# EAGLE design nodeBoard (EAGLE 8.6.0)
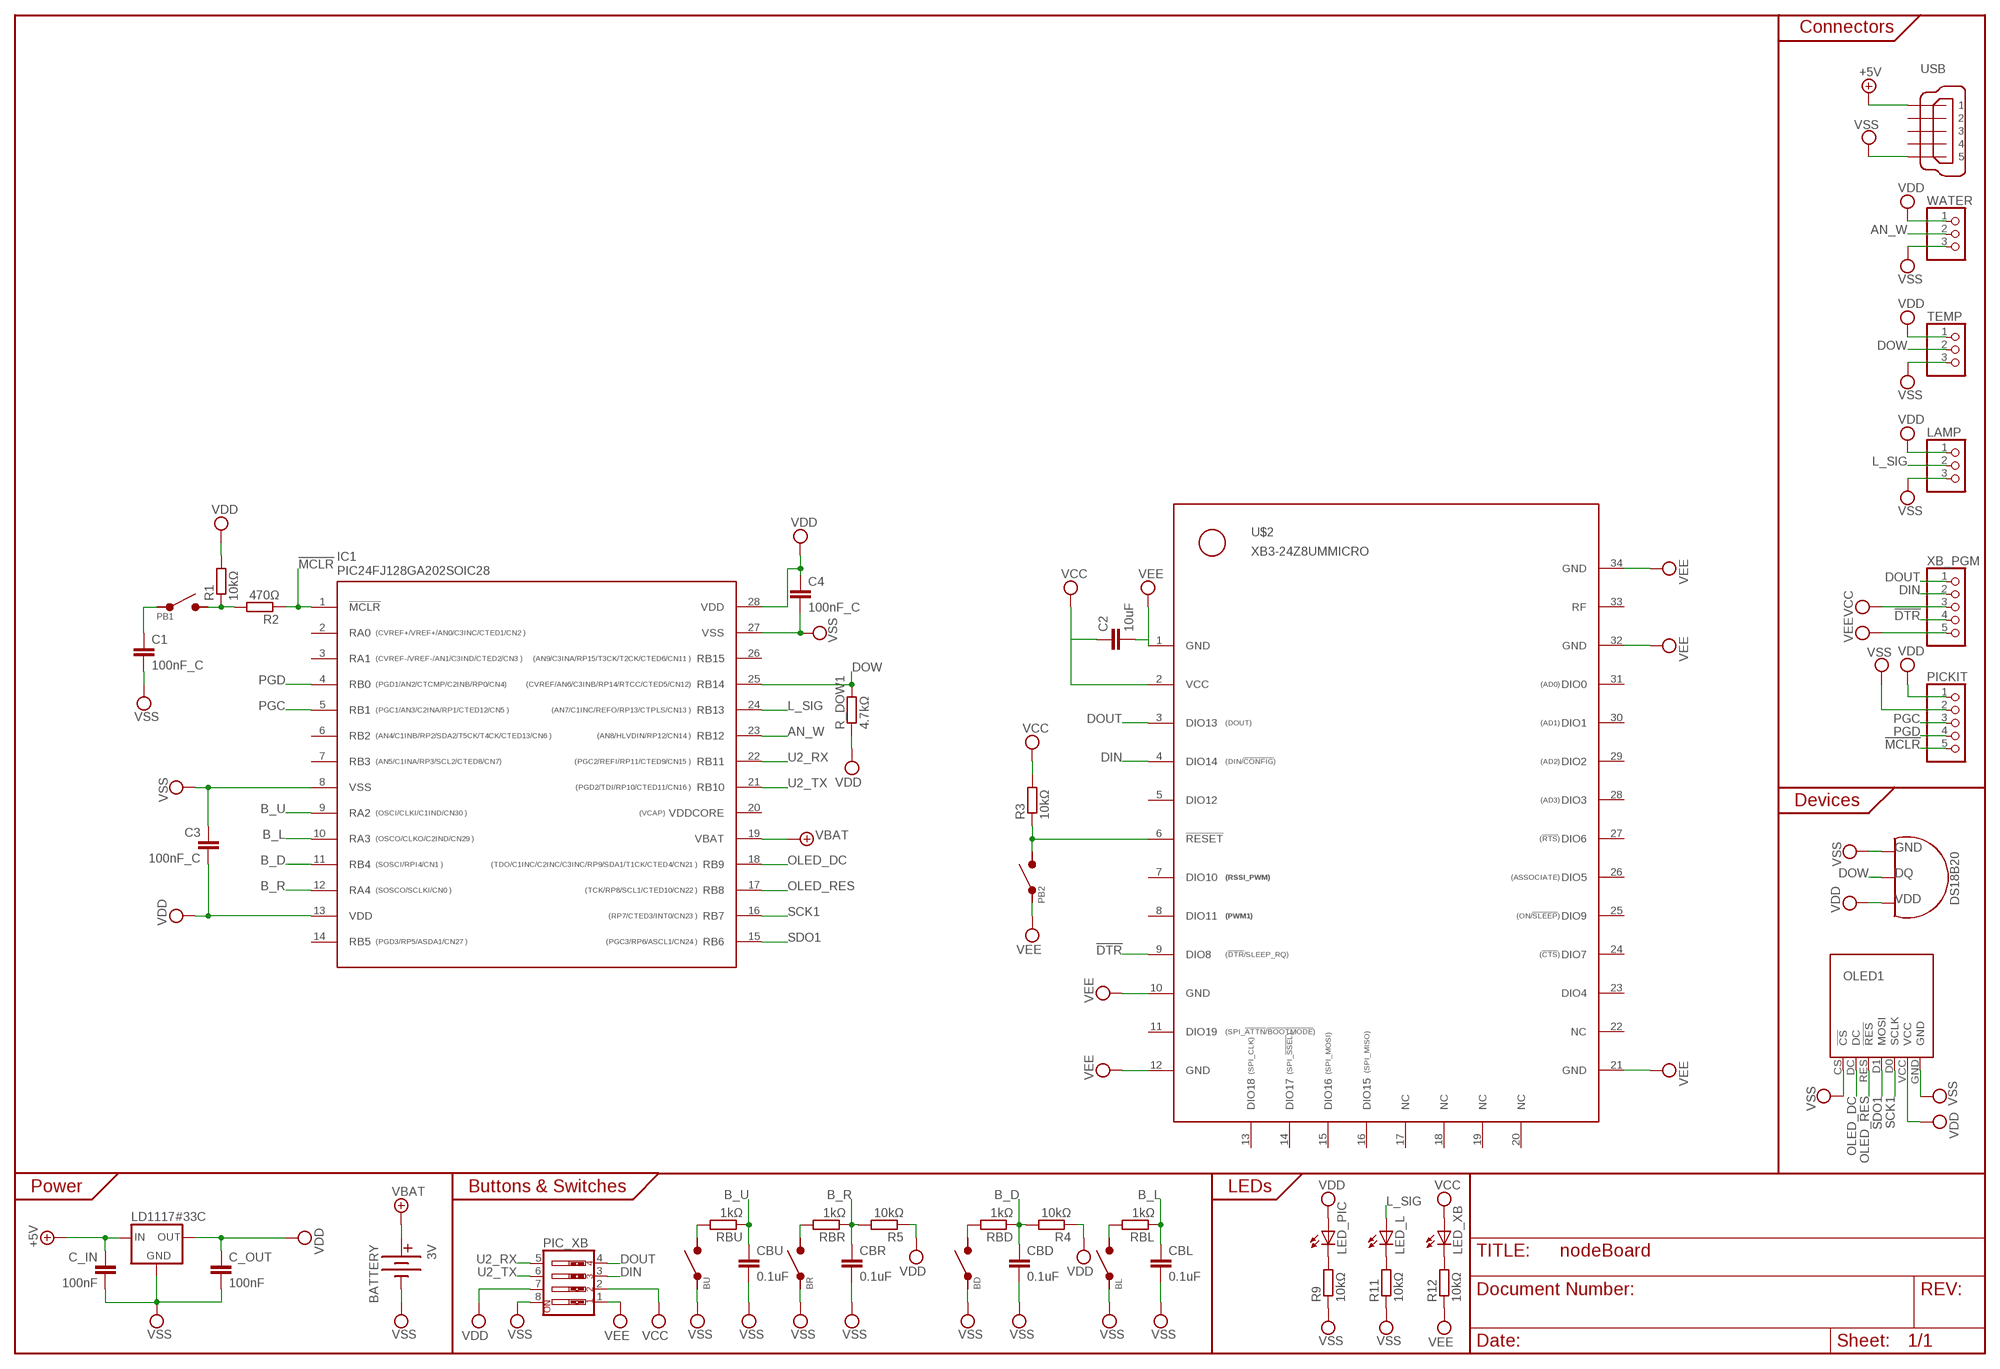
[diagram p0: schematic, sheet 1]

## Parts
3V  BATTERY  [20MM_CELLHOLDER]
BD  PUSHBUTTON_4LEG_SMD  [TACTILE_SWITCH_SMD_6.2MM_BROWN]
BL  PUSHBUTTON_4LEG_SMD  [TACTILE_SWITCH_SMD_6.2MM_BROWN]
BR  PUSHBUTTON_4LEG_SMD  [TACTILE_SWITCH_SMD_6.2MM_BROWN]
BU  PUSHBUTTON_4LEG_SMD  [TACTILE_SWITCH_SMD_6.2MM_BROWN]
C1  100nF_C  C-EUC0805  [C0805]
C2  10uF  C-EUC0805  [C0805]
C3  100nF_C  C-EUC0805  [C0805]
C4  100nF_C  C-EUC0805  [C0805]
C_IN  100nF  C-EUC0805  [C0805]
C_OUT  100nF  C-EUC0805  [C0805]
CBD  0.1uF  C-EUC0805  [C0805]
CBL  0.1uF  C-EUC0805  [C0805]
CBR  0.1uF  C-EUC0805  [C0805]
CBU  0.1uF  C-EUC0805  [C0805]
IC1  PIC24FJ128GA202SOIC28  [SOIC28L]
LAMP  PINHD-1X3  [1X03]
LED_L  LEDCHIPLED_0805  [CHIPLED_0805]
LED_PIC  LEDCHIPLED_0805  [CHIPLED_0805]
LED_XB  LEDCHIPLED_0805  [CHIPLED_0805]
OLED1  OLED_7PIN_SPI  [OLED_7PIN]
PB1  PUSHBUTTON_2LEG  [PUSHBUTTON_6X3.5MM]
PB2  PUSHBUTTON_2LEG  [PUSHBUTTON_6X3.5MM]
PIC_XB  SW_DIP-4  [EDG-04]
PICKIT  PINHD-1X5  [1X05]
R1  10kΩ  R-EU_R0805  [R0805]
R2  470Ω  R-EU_R0805  [R0805]
R3  10kΩ  R-EU_R0805  [R0805]
R4  10kΩ  R-EU_R0805  [R0805]
R5  10kΩ  R-EU_R0805  [R0805]
R9  10kΩ  R-EU_R0805  [R0805]
R11  10kΩ  R-EU_R0805  [R0805]
R12  10kΩ  R-EU_R0805  [R0805]
R_DOW1  4.7kΩ  R-EU_R0805  [R0805]
RBD  1kΩ  R-EU_R0805  [R0805]
RBL  1kΩ  R-EU_R0805  [R0805]
RBR  1kΩ  R-EU_R0805  [R0805]
RBU  1kΩ  R-EU_R0805  [R0805]
TEMP  PINHD-1X3  [1X03]
U$1  LD1117#33C  [DPACK]
U$2  XB3-24Z8UMMICRO  [XBEE3_MICRO]
U$7  DS18B20  [TO92]
USB  MINI-USB-32005-201  [32005-201]
WATER  PINHD-1X3  [1X03]
XB_PGM  PINHD-1X5  [1X05]

## Nets
!DTR: U$2.9(DIO8) XB_PGM.4
!MCLR: IC1.1(!MCLR) PICKIT.5 R2.1
+5V: C_IN.1 U$1.3(IN) USB.1
AN_W: IC1.23(RB12) WATER.2
B_D: CBD.1 IC1.11(RB4) R4.2 RBD.1
B_L: CBL.1 IC1.10(RA3) RBL.1
B_R: CBR.1 IC1.12(RA4) R5.2 RBR.1
B_U: CBU.1 IC1.9(RA2) RBU.1
DIN: PIC_XB.3 U$2.4(DIO14) XB_PGM.2
DOUT: PIC_XB.4 U$2.3(DIO13) XB_PGM.1
DOW: IC1.25(RB14) R_DOW1.2 TEMP.2 U$7.2(DQ)
L_SIG: IC1.24(RB13) LAMP.2 LED_L.A
N$1: C1.1 PB1.P$1
N$2: PB2.P$2 R3.1 U$2.6(!RESET)
N$3: PB1.P$2 R1.1 R2.2
N$4: BU.B1 BU.B2 RBU.2
N$6: BL.B1 BL.B2 RBL.2
N$7: BR.B1 BR.B2 RBR.2
N$8: BD.B1 BD.B2 RBD.2
N$9: LED_L.C R11.2
N$10: LED_XB.C R12.2
N$11: LED_PIC.C R9.2
OLED_DC: IC1.18(RB9) OLED1.DC
OLED_RES: IC1.17(RB8) OLED1.RES(!RES)
PGC: IC1.5(RB1) PICKIT.3
PGD: IC1.4(RB0) PICKIT.4
SCK1: IC1.16(RB7) OLED1.D0(SCLK)
SDO1: IC1.15(RB6) OLED1.D1(MOSI)
U2_RX: IC1.22(RB11) PIC_XB.5
U2_TX: IC1.21(RB10) PIC_XB.6
VBAT: 3V.+@1(+) 3V.+@2(+) IC1.19(VBAT)
VCC: C2.1 LED_XB.A PIC_XB.2 R3.2 U$2.2(VCC) XB_PGM.3
VDD: C3.2 C4.1 C_OUT.1 IC1.13(VDD) IC1.28(VDD) LAMP.1 LED_PIC.A OLED1.VCC PIC_XB.7 PICKIT.1 R1.2 R4.1 R5.1 R_DOW1.1 TEMP.1 U$1.2(OUT) U$7.3(VDD) WATER.1
VEE: C2.2 PB2.P$1 PIC_XB.1 R12.1 U$2.1(GND) U$2.10(GND) U$2.12(GND) U$2.21(GND) U$2.32(GND) U$2.34(GND) XB_PGM.5
VSS: 3V.- BD.A1 BD.A2 BL.A1 BL.A2 BR.A1 BR.A2 BU.A1 BU.A2 C1.2 C3.1 C4.2 C_IN.2 C_OUT.2 CBD.2 CBL.2 CBR.2 CBU.2 IC1.8(VSS) IC1.27(VSS) LAMP.3 OLED1.CS(!CS) OLED1.GND PIC_XB.8 PICKIT.2 R9.1 R11.1 TEMP.3 U$1.1(GND) U$7.1(GND) USB.5 WATER.3
Unconnected: IC1.2(RA0) IC1.3(RA1) IC1.6(RB2) IC1.7(RB3) IC1.14(RB5) IC1.26(RB15) U$2.5(DIO12) U$2.7(DIO10) U$2.8(DIO11) U$2.11(DIO19) U$2.13(DIO18) U$2.14(DIO17) U$2.15(DIO16) U$2.16(DIO15) U$2.17(NC) U$2.18(NC) U$2.19(NC) U$2.20(NC) U$2.22(NC) U$2.23(DIO4) U$2.24(DIO7) U$2.25(DIO9) U$2.26(DIO5) U$2.27(DIO6) U$2.28(DIO3) U$2.29(DIO2) U$2.30(DIO1) U$2.31(DIO0) U$2.33(RF) USB.2 USB.3 USB.4

## Notes on the sheet
- Connectors
- Devices
- Power | Buttons & Switches | LEDs

## Power pins joined to a net without a drawn wire
VDDCORE: IC1.20(VDDCORE)

## Library data of the parts
3V = CustomLib:BATTERY
BD BL BR BU = CustomLib:PUSHBUTTON_4LEG_SMD
C1-C4 C_IN C_OUT CBD CBL CBR CBU = rcl:C-EU: CAPACITOR, European symbol; SPICEPREFIX: C
IC1 = CustomLib:PIC24FJ128GA202
LAMP TEMP WATER = pinhead:PINHD-1X3: PIN HEADER
LED_L LED_PIC LED_XB = led:LED: LED OSRAM: - CHIPLED LG R971, LG N971, LY N971, LG Q971, LY Q971, LO R971, LY R971 LH N974, LH R974 LS Q976, LO Q976, LY Q976 LO Q996 - Hyper CHIPLED LW Q18S LB Q993, LB Q99A, LB R99A - SideLED LS A670, LO A670, LY A670, LG A670, LP A670 LB A673, LV A673, LT A673, LW A673 LH A674 LY A675 LS A676, LA A676, LO A676, LY A676, LW A676 LS A679, LY A679, LG A679 - Hyper Micro SIDELED® LS Y876, LA Y876, LO Y876, LY Y876 LT Y87S - SmartLED LW L88C, LW L88S LB L89C, LB L89S, LG L890 LS L89K, LO L89K, LY L89K LS L896, LA L896, LO L896, LY L896 - TOPLED LS T670, LO T670, LY T670, LG T670, LP T670 LSG T670, LSP T670, LSY T670, LOP T670, LYG T670 LG T671, LOG T671, LSG T671 LB T673, LV T673, LT T673, LW T673 LH T674 LS T676, LA T676, LO T676, LY T676, LB T676, LH T676, LSB T676, LW T676 LB T67C, LV T67C, LT T67C, LS T67K, LO T67K, LY T67K, LW E67C LS E67B, LA E67B, LO E67B, LY E67B, LB E67C, LV E67C, LT E67C LW T67C LS T679, LY T679, LG T679 LS T770, LO T770, LY T770, LG T770, LP T770 LB T773, LV T773, LT T773, LW T773 LH T774 LS E675, LA E675, LY E675, LS T675 LS T776, LA T776, LO T776, LY T776, LB T776 LHGB T686 LT T68C, LB T68C - Hyper Mini TOPLED® LB M676 - Mini TOPLED Santana® LG M470 LS M47K, LO M47K, LY M47K Source: http://www.osram.convergy.de LUXEON: - LUMILED® LXK2-PW12-R00, LXK2-PW12-S00, LXK2-PW14-U00, LXK2-PW14-V00 LXK2-PM12-R00, LXK2-PM12-S00, LXK2-PM14-U00 LXK2-PE12-Q00, LXK2-PE12-R00, LXK2-PE12-S00, LXK2-PE14-T00, LXK2-PE14-U00 LXK2-PB12-K00, LXK2-PB12-L00, LXK2-PB12-M00, LXK2-PB14-N00, LXK2-PB14-P00, LXK2-PB14-Q00 LXK2-PR12-L00, LXK2-PR12-M00, LXK2-PR14-Q00, LXK2-PR14-R00 LXK2-PD12-Q00, LXK2-PD12-R00, LXK2-PD12-S00 LXK2-PH12-R00, LXK2-PH12-S00 LXK2-PL12-P00, LXK2-PL12-Q00, LXK2-PL12-R00 Source: www.luxeon.com KINGBRIGHT: KA-3528ASYC Source: www.kingbright.com
OLED1 = CustomLib:OLED_7PIN_SPI
PB1 PB2 = CustomLib:PUSHBUTTON_2LEG
PIC_XB = special:SW_DIP-4: DIP SWITCH
PICKIT XB_PGM = pinhead:PINHD-1X5: PIN HEADER
R1-R5 R9 R11 R12 R_DOW1 RBD RBL RBR RBU = rcl:R-EU_: RESISTOR, European symbol; SPICEPREFIX: R
U$1 = CustomLib:LD1117#33C
U$2 = CustomLib:XB3-24Z8UM: XB3-24Z8UM Xbee 3 micro module by DIGI international. Based on mechanical drawings in Xbee3 RF Module Hardware Reference Manual (90001543) by Digi Intrnational. Untested. Made by Nikolai Nymo
U$7 = CustomLib:DS18B20
USB = con-cypressindustries:MINI-USB-: MINI USB-B Conector Source: www.cypressindustries.com; OC_FARNELL: unknown; OC_NEWARK: unknown

## Board
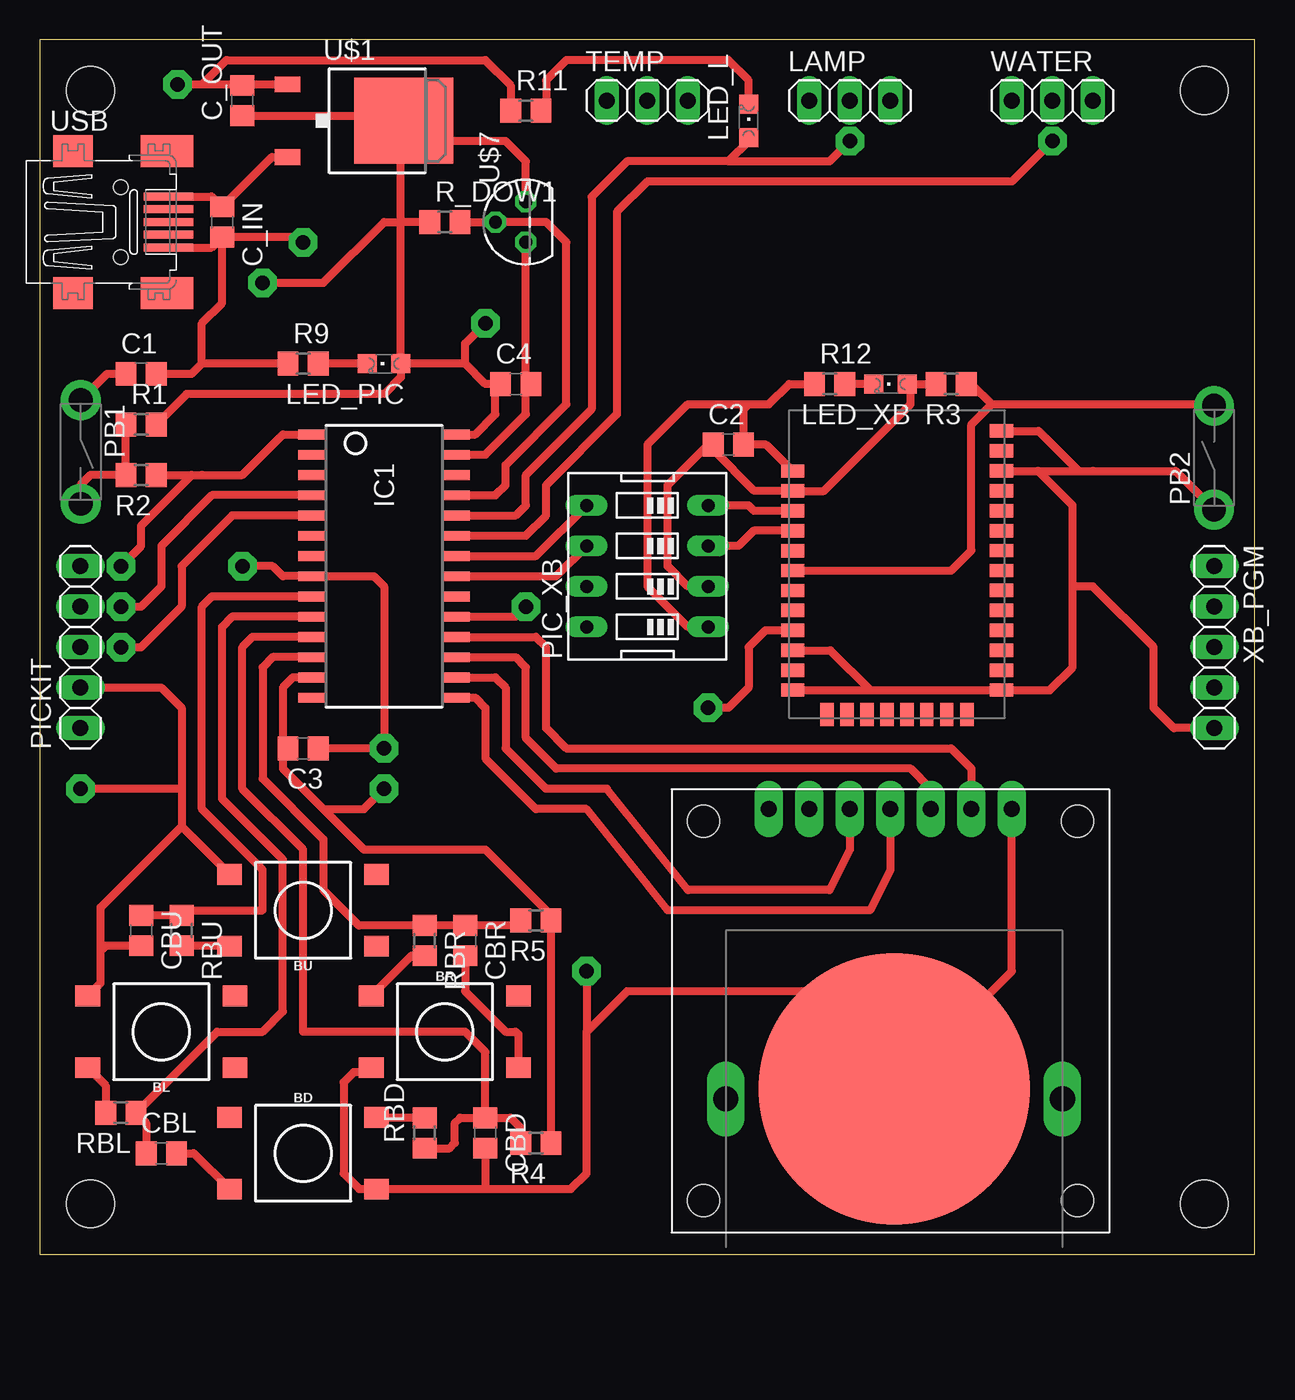
[diagram p1: board, top side]
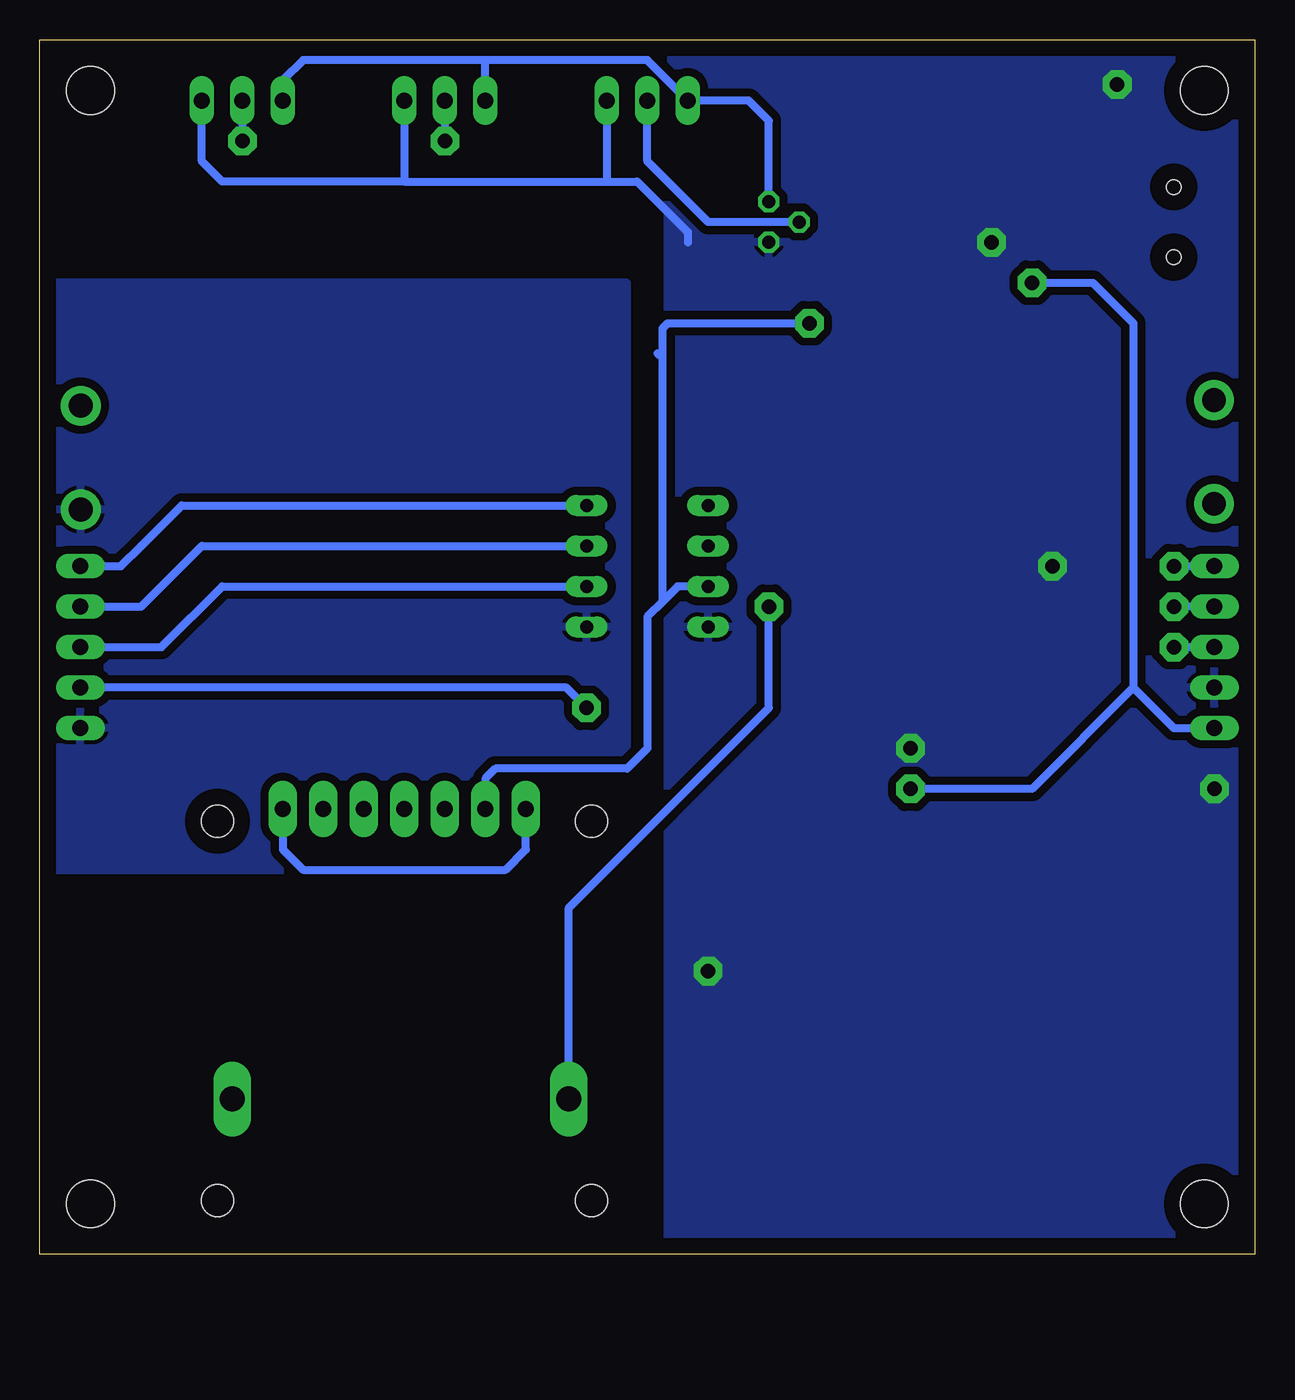
[diagram p2: board, bottom side, seen from below]

Size 76.2 x 76.2 mm. Coordinates in mm from the lower left corner, seen from the top.
Outline: 0,0 76.2,0 76.2,76.2 0,76.2 0,0
Copper layers (1*16): Top 0.035mm / dielectric 1.5mm / Bottom 0.035mm
Design rules "default *": minimum track width 6mil, minimum drill 0.35mm, track to track 6mil, track to pad 6mil, pad to pad 6mil, via to via 6mil, smd to smd 6mil, copper to edge 40mil, drill to drill 6mil, minimum pad ring 10mil, minimum via ring 8mil, stop-mask expansion 4mil, vias tented up to drill 0mil, thermal gap 10mil
Holes 3 mm at 3.17,73.03 73.03,73.03 73.03,3.17 3.17,3.17

### Footprints (pad centres in the part's own frame; a part is rotated, then mirrored left to right if it is on the bottom)
20MM_CELLHOLDER = drill 1.575 long: +@1 0,10.566; +@2 21.107,10.566 | smd 17 x 17: - 10.554,9.931
TACTILE_SWITCH_SMD_6.2MM_BROWN = smd 1.55 x 1.3: A1 -4.61,-2.25; A2 4.61,-2.25; B1 -4.61,2.25; B2 4.61,2.25
C0805 = smd 1.3 x 1.5: 1 -0.95,0; 2 0.95,0
SOIC28L = smd 0.6 x 1.8: 1 -8.255,-4.475; 2 -6.985,-4.475; 3 -5.715,-4.475; 4 -4.445,-4.475; 5 -3.175,-4.475; 6 -1.905,-4.475; 7 -0.635,-4.475; 8 0.635,-4.475; 9 1.905,-4.475; 10 3.175,-4.475; 11 4.445,-4.475; 12 5.715,-4.475; 13 6.985,-4.475; 14 8.255,-4.475; 15 8.255,4.475; 16 6.985,4.475; 17 5.715,4.475; 18 4.445,4.475; 19 3.175,4.475; 20 1.905,4.475; 21 0.635,4.475; 22 -0.635,4.475; 23 -1.905,4.475; 24 -3.175,4.475; 25 -4.445,4.475; 26 -5.715,4.475; 27 -6.985,4.475; 28 -8.255,4.475
1X03 = drill 1.016 long: 1 -2.54,0; 2 0,0; 3 2.54,0
CHIPLED_0805 = smd 1.2 x 1.2: A 0,-1.05; C 0,1.05
OLED_7PIN = drill 1 pad 1.778 long: CS -7.62,-0.006; D0 2.54,-0.006; D1 0,-0.006; DC -5.08,-0.006; GND 7.62,-0.006; RES -2.54,-0.006; VCC 5.08,-0.006 | hole 2: -11.725,24.569; -11.725,0.769; 11.725,0.769; 11.725,24.569
PUSHBUTTON_6X3.5MM = drill 1.5 pad 2.5: P$1 1.25,-0.25; P$2 1.25,6.25
EDG-04 = drill 0.813 long: 1 -3.81,-3.81; 2 -1.27,-3.81; 3 1.27,-3.81; 4 3.81,-3.81; 5 3.81,3.81; 6 1.27,3.81; 7 -1.27,3.81; 8 -3.81,3.81
1X05 = drill 1.016 long: 1 -5.08,0; 2 -2.54,0; 3 0,0; 4 2.54,0; 5 5.08,0
R0805 = smd 1.3 x 1.5: 1 -0.95,0; 2 0.95,0
DPACK = smd 1 x 1.6: 1 -2.28,-4.8; 3 2.28,-4.8 | smd 5.4 x 6.2: 2 0,2.5
XBEE3_MICRO = smd 1.448 x 0.838: 1 0.216,15.494; 2 0.216,14.244; 3 0.216,12.995; 4 0.216,11.745; 5 0.216,10.495; 6 0.216,9.246; 7 0.216,7.996; 8 0.216,6.746; 9 0.216,5.497; 10 0.216,4.247; 11 0.216,2.997; 12 0.216,1.753; 21 13.322,1.753; 22 13.322,3.002; 23 13.322,4.252; 24 13.322,5.502; 25 13.322,6.751; 26 13.322,8.001; 27 13.322,9.251; 28 13.322,10.5; 29 13.322,11.75; 30 13.322,13; 31 13.322,14.249; 32 13.322,15.499; 33 13.322,16.749; 34 13.322,18.009 | smd 0.838 x 1.448: 13 2.388,0.216; 14 3.637,0.216; 15 4.887,0.216; 16 6.137,0.216; 17 7.386,0.216; 18 8.636,0.216; 19 9.886,0.216; 20 11.151,0.216
TO92 = drill 0.813 octagon: 1 -1.27,0; 2 0,1.905; 3 1.27,0
32005-201 = smd 3.1 x 0.5: 1 3,1.6; 2 3,0.8; 3 3,0; 4 3,-0.8; 5 3,-1.6 | smd 2.5 x 2: M1 -3,-4.45; M2 -3,4.45 | smd 3.3 x 2: M3 2.9,4.45; M4 2.9,-4.45 | hole 0.9: 0,2.2; 0,-2.2

### Placement (x,y rotation side)
3V  64.14,20.32 180 top
BD  16.51,6.35 0 top
BL  7.62,13.97 180 top
BR  25.4,13.97 0 top
BU  16.51,21.59 180 top
C1  6.35,55.24 0 top
C2  43.18,50.8 0 top
C3  16.51,31.75 180 top
C4  29.84,54.61 0 top
C_IN  11.43,64.77 270 top
C_OUT  12.7,72.39 90 top
CBD  27.94,7.62 270 top
CBL  7.62,6.35 0 top
CBR  26.67,19.68 270 top
CBU  6.35,20.32 270 top
IC1  21.59,43.18 270 top
LAMP  50.8,72.39 0 top
LED_L  44.45,71.12 0 top
LED_PIC  21.59,55.88 90 top
LED_XB  53.34,54.61 90 top
OLED1  53.34,27.94 180 top
PB1  3.81,53.34 180 top
PB2  72.39,46.99 0 top
PIC_XB  38.1,43.18 90 top
PICKIT  2.54,38.1 90 top
R1  6.35,52.07 0 top
R2  6.35,48.9 180 top
R3  57.15,54.61 180 top
R4  31.11,6.99 180 top
R5  31.11,20.95 180 top
R9  16.51,55.88 0 top
R11  30.48,71.75 0 top
R12  49.53,54.61 0 top
R_DOW1  25.4,64.77 0 top
RBD  24.13,7.62 90 top
RBL  5.08,8.89 180 top
RBR  24.13,19.68 270 top
RBU  8.89,20.32 270 top
TEMP  38.1,72.39 0 top
U$1  20.32,71.12 270 top
U$2  46.99,33.66 0 top
U$7  30.48,64.77 90 top
USB  5.08,64.77 0 top
WATER  63.5,72.39 0 top
XB_PGM  73.66,38.1 270 top

### Tracks (layer width: path | path; a pad name or v marks a point on that pad's centre or on a via)
!DTR  (via drill 0.9 pad 1.8)
  Top 0.508: U$2.9 45.5,39.15 44.45,38.1 44.45,35.56 43.18,34.29 v41.91,34.29
  Bottom 0.508: v41.91,34.29 43.18,35.56 XB_PGM.4
!MCLR  (via drill 0.9 pad 1.8)
  Top 0.508: 9.53,48.9 6.35,45.72 6.35,44.45 v5.08,43.18 | 9.53,48.9 10.16,48.9 12.7,48.9 15.24,51.44 IC1.1 | R2.1 9.53,48.9
  Bottom 0.508: v5.08,43.18 PICKIT.5
+5V
  Top 0.508: USB.1 10.78,66.37 C_IN.1 14.55,68.84 U$1.3
AN_W  (via drill 0.9 pad 1.8)
  Top 0.508: IC1.23 30.48,45.09 31.75,46.35 31.75,48.26 36.2,52.7 36.2,65.41 38.1,67.31 60.96,67.31 v63.5,69.85
  Bottom 0.508: WATER.2 v63.5,69.85
B_D
  Top 0.508: IC1.11 13.34,38.73 12.7,38.1 12.7,29.21 16.51,25.4 16.51,13.97 26.67,13.97 27.94,12.7 CBD.1 | RBD.1 25.72,6.67 26.04,6.99 26.04,8.26 26.35,8.57 CBD.1 | CBD.1 29.53,8.57 30.16,7.93 R4.2
B_L
  Top 0.508: IC1.10 12.06,40.01 11.43,39.37 11.43,28.57 15.24,24.77 15.24,15.24 13.97,13.97 11.11,13.97 RBL.1 6.67,8.25 CBL.1
B_R
  Top 0.508: IC1.12 14.61,37.47 13.97,36.83 13.97,29.84 17.78,26.04 17.78,22.86 20,20.64 RBR.1 CBR.1 29.84,20.64 R5.2
B_U
  Top 0.508: IC1.9 10.79,41.27 10.16,40.64 10.16,27.94 13.97,24.13 13.97,21.59 9.21,21.59 RBU.1 CBU.1
DIN
  Top 0.508: U$2.4 44.77,45.4 43.81,44.45 PIC_XB.3
  Bottom 0.508: XB_PGM.2 69.85,40.64 66.04,44.45 PIC_XB.3
DOUT
  Top 0.508: U$2.3 44.79,46.65 44.45,46.99 PIC_XB.4
  Bottom 0.508: XB_PGM.1 71.12,43.18 69.85,44.45 | 69.85,44.45 67.31,46.99 PIC_XB.4 | 69.85,44.45
DOW
  Top 0.508: IC1.25 28.57,47.62 29.21,48.26 29.21,49.53 33.02,53.34 33.02,63.5 31.75,64.77 U$7.2 R_DOW1.2
  Bottom 0.508: U$7.2 34.29,64.77 38.1,68.58 TEMP.2
L_SIG  (via drill 0.9 pad 1.8)
  Top 0.508: IC1.24 29.84,46.35 30.48,46.99 30.48,48.9 34.61,53.02 34.61,66.36 36.83,68.58 43.18,68.58 | 43.18,68.58 44.45,69.85 LED_L.A | 43.18,68.58 49.53,68.58 v50.8,69.85
  Bottom 0.508: LAMP.2 v50.8,69.85
N$1
  Top 0.508: PB1.P$1 4.21,55.24 C1.1
N$2
  Top 0.508: U$2.6 57.15,42.9 58.42,44.17 58.42,52.07 59.69,53.34 | 59.69,53.34 73.54,53.34 PB2.P$2 | R3.1 58.42,54.61 59.69,53.34
N$3
  Top 0.508: PB1.P$2 2.56,48.24 2.54,48.26 3.17,48.9 R2.2 R1.1
N$4
  Top 0.508: BU.B2 8.92,19.34 RBU.2
N$6
  Top 0.508: BL.B2 4.13,10.6 RBL.2
N$7
  Top 0.508: BR.B1 23.3,18.73 RBR.2
N$8
  Top 0.508: BD.B2 24.1,8.6 RBD.2
N$9
  Top 0.508: LED_L.C 44.45,73.66 43.18,74.93 33.02,74.93 31.75,73.66 31.75,72.08 R11.2
N$10
  Top 0.508: LED_XB.C R12.2
N$11
  Top 0.508: LED_PIC.C R9.2
OLED_DC
  Top 0.508: IC1.18 31.11,38.73 31.75,38.1 31.75,33.02 33.02,31.75 57.15,31.75 58.42,30.48 OLED1.DC | OLED1.DC
OLED_RES
  Top 0.508: IC1.17 29.84,37.47 30.48,36.83 30.48,32.38 32.38,30.48 54.61,30.48 55.88,29.21 OLED1.RES
PGC  (via drill 0.9 pad 1.8)
  Top 0.508: IC1.5 12.06,46.35 8.89,43.18 8.89,40.64 6.35,38.1 v5.08,38.1
  Bottom 0.508: v5.08,38.1 PICKIT.3
PGD  (via drill 0.9 pad 1.8)
  Top 0.508: IC1.4 10.79,47.62 7.62,44.45 7.62,41.91 6.35,40.64 v5.08,40.64
  Bottom 0.508: PICKIT.4 v5.08,40.64
SCK1
  Top 0.508: OLED1.D0 | OLED1.D0 50.8,26.67 | OLED1.D0 50.8,25.4 | 50.8,25.4 | 50.8,25.4 49.53,22.86 40.64,22.86 35.56,29.21 31.75,29.21 29.21,31.75 29.21,35.56 28.57,36.2 IC1.16
SDO1
  Top 0.508: OLED1.D1 | OLED1.D1 53.34,24.13 52.07,21.59 39.37,21.59 34.29,27.94 31.11,27.94 27.94,31.11 27.94,34.29 27.3,34.92 IC1.15
U2_RX
  Top 0.508: IC1.22 31.11,43.81 PIC_XB.5
U2_TX
  Top 0.508: IC1.21 32.38,42.55 PIC_XB.6
VBAT  (via drill 0.9 pad 1.8)
  Top 0.508: IC1.19 29.84,40.01 v30.48,40.64
  Bottom 0.508: 3V.+@2 43.03,21.74 30.48,34.29 v30.48,40.64
VCC
  Top 0.508: PIC_XB.2 40.64,41.91 39.37,43.18 39.37,48.26 41.91,50.8 C2.1 42.23,50.48 44.81,47.9 U$2.2 49.17,47.9 54.61,53.34 54.61,54.61 | LED_XB.A 54.61,54.61 | 54.61,54.61 R3.2
  Bottom 0.508: XB_PGM.3 68.58,38.1 64.77,41.91 PIC_XB.2
VDD  (via drill 0.9 pad 1.8)
  Top 0.508: IC1.13 15.88,36.2 15.24,35.56 15.24,31.75 | C_OUT.1 22.5,71.44 U$1.2 | IC1.28 27.3,51.44 28.57,52.7 28.57,54.29 C4.1 27.94,54.61 26.67,55.88 | 26.67,55.88 LED_PIC.A | LED_PIC.A 22.64,55.02 21.59,53.98 9.21,53.98 R1.2 | LED_PIC.A 22.64,64.77 | 22.64,64.77 22.64,69.85 | 22.64,69.85 22.64,70.94 U$1.2 | 24.09,72.39 U$1.2 | R_DOW1.1 22.64,64.77 | U$7.3 30.48,68.58 29.21,69.85 22.64,69.85 | C3.2 15.24,31.75 | 15.24,31.75 15.24,30.48 17.78,27.94 | 17.78,27.94 20.32,25.4 27.94,25.4 32.06,21.27 R5.1 R4.1 | v13.97,60.96 17.78,60.96 21.59,64.77 22.64,64.77 | 26.67,55.88 26.67,57.15 v27.94,58.42 | 17.78,27.94 20.32,27.94 v21.59,29.21
  Bottom 0.508: 48.26,74.93 59.69,74.93 60.96,73.66 WATER.1 | LAMP.1 48.26,74.93 | 48.26,74.93 38.1,74.93 TEMP.1 31.75,72.39 30.48,71.12 U$7.3 | v13.97,60.96 10.16,60.96 7.62,58.42 7.62,35.56 | 7.62,35.56 5.08,33.02 PICKIT.1 | PIC_XB.7 36.2,41.91 37.15,40.96 | 37.15,40.96 38.1,40.01 38.1,31.75 39.37,30.48 47.62,30.48 48.26,29.84 OLED1.VCC | 37.15,40.96 37.15,56.2 | 37.15,56.2 37.47,56.52 | 37.15,56.2 37.15,58.1 36.83,58.42 v27.94,58.42 | 7.62,35.56 13.97,29.21 v21.59,29.21
VEE
  Top 0.508: U$2.1 45.55,50.8 C2.2 44.13,53.02 44.45,53.34 | PIC_XB.1 40.64,39.37 38.1,41.91 38.1,50.8 40.64,53.34 44.45,53.34 | 44.45,53.34 45.72,53.34 46.99,54.61 R12.1 | U$2.32 62.61,49.15 | 62.61,49.15 65.15,49.15 | PB2.P$1 71.23,49.15 66.04,49.15 65.15,49.15 | U$2.12 52.07,35.41 | 52.07,35.41 U$2.21 63.35,35.41 64.77,36.83 64.77,41.91 | U$2.10 49.58,37.9 52.07,35.41 | 64.77,41.91 64.77,46.99 62.61,49.15 | XB_PGM.5 71.12,33.02 69.85,34.29 69.85,38.1 66.04,41.91 64.77,41.91 | U$2.34 62.64,51.66 65.15,49.15
  pour Bottom (isolate 0.508): 76.2,24.13 39.37,24.13 39.37,60.96 76.2,60.96
VSS  (via drill 0.9 pad 1.8)
  Top 0.508: v12.7,43.18 14.61,43.18 15.24,42.55 IC1.8 20.95,42.55 21.59,41.91 v21.59,31.75 C3.1 | USB.5 10.78,63.17 C_IN.2 | C_IN.2 11.43,59.69 10.16,58.42 10.16,55.88 | C1.2 9.53,55.24 10.16,55.88 | U$1.1 12.76,73.4 | 12.76,73.4 C_OUT.2 | 12.76,73.4 10.16,73.4 | 10.16,73.4 v8.64,73.4 v8.64,73.41 | IC1.27 27.94,50.16 30.48,52.7 30.48,54.3 C4.2 30.48,54.92 U$7.1 | R9.1 10.16,55.88 | 10.16,73.4 11.69,74.93 27.94,74.93 29.53,73.34 R11.1 | v16.51,63.5 16.19,63.82 C_IN.2 | CBL.2 9.65,6.35 BD.A1 | BL.A2 3.81,17.02 3.81,19.05 | 3.81,19.05 3.81,21.77 8.89,26.85 | 11.61,24.13 BU.A2 8.89,26.85 | CBU.2 4.13,19.37 3.81,19.05 | PICKIT.2 7.62,35.56 8.89,34.29 8.89,29.21 | 8.89,29.21 8.89,26.85 | OLED1.CS | OLED1.CS 60.96,17.77 3V.- 53.58,15 52.07,16.51 36.83,16.51 34.29,13.97 | 27.94,4.1 BD.A2 20.03,4.1 19.05,5.08 19.05,10.79 19.68,11.43 20.5,11.43 BR.A1 | 27.94,4.1 33.31,4.1 34.29,5.08 34.29,13.97 | CBD.2 27.94,4.1 | CBR.2 26.67,16.51 29.21,13.97 29.84,13.97 30.01,13.8 BR.A2 | 8.89,29.21 v2.54,29.21 | v34.29,17.78 34.29,13.97
  Bottom 0.508: WATER.3 66.04,68.58 64.77,67.31 53.34,67.31 | LAMP.3 53.34,67.31 | 35.56,63.5 35.56,64.14 38.73,67.31 40.64,67.31 | 53.34,67.31 40.64,67.31 | TEMP.3 40.64,67.31 | OLED1.CS 60.96,25.4 | 60.96,25.4 | 60.96,25.4 59.69,24.13 46.99,24.13 45.72,25.4 OLED1.GND
  pour Bottom (isolate 0.508): 0,0 36.83,0 36.83,76.2 0,76.2